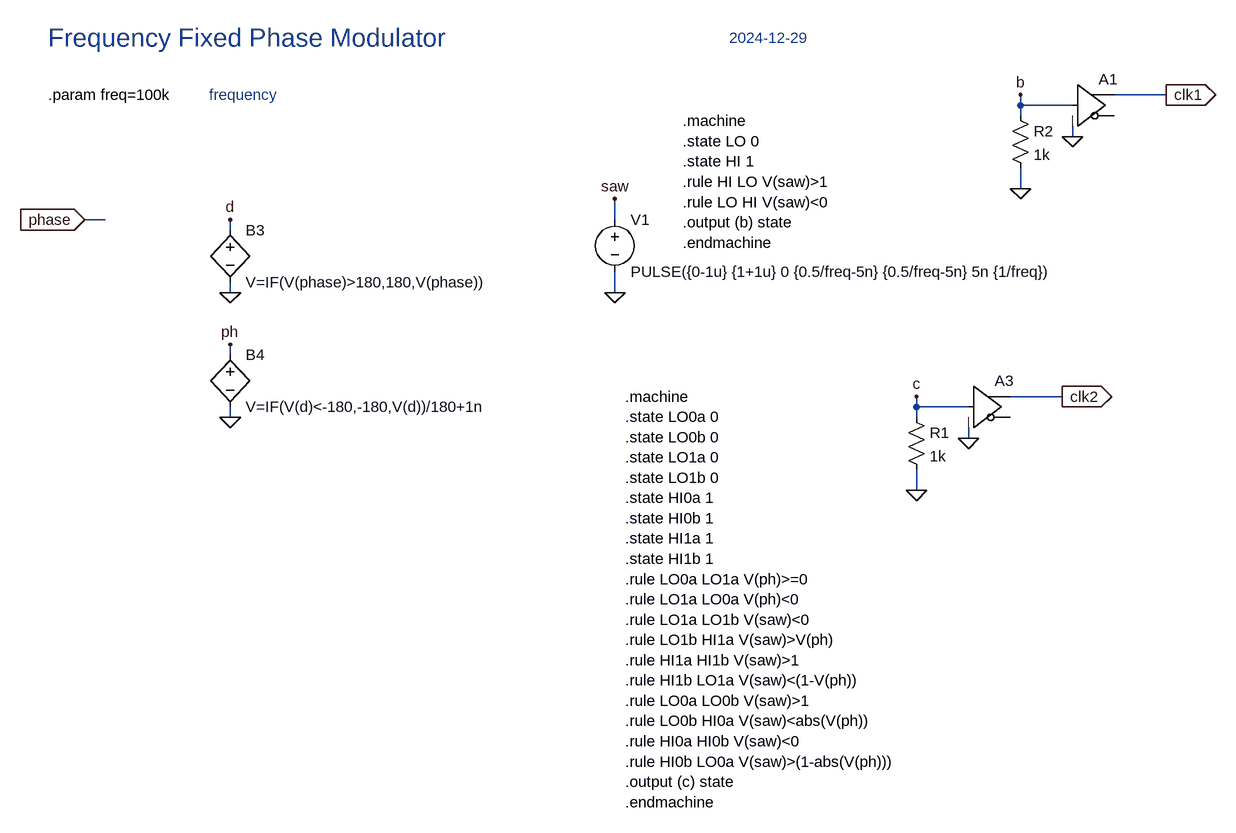
[diagram p0: schematic PHASESHIFT.asc]
PHASESHIFT.asc, the LTspice schematic file:
Version 4
SHEET 1 1572 1312
WIRE 560 16 480 16
WIRE 336 32 336 16
WIRE 416 32 336 32
WIRE 336 48 336 32
WIRE 416 80 416 64
WIRE 336 160 336 128
WIRE -1072 208 -1104 208
WIRE -288 208 -288 176
WIRE -880 224 -880 208
WIRE -880 320 -880 304
WIRE -288 320 -288 288
WIRE -880 416 -880 400
WIRE 400 480 320 480
WIRE 176 496 176 480
WIRE 256 496 176 496
WIRE -880 512 -880 496
WIRE 176 512 176 496
WIRE 256 544 256 528
WIRE 176 624 176 592
FLAG -1104 208 phase
IOPIN -1104 208 In
FLAG 336 160 0
FLAG -880 320 0
FLAG -880 208 d
FLAG 560 16 clk1
IOPIN 560 16 Out
FLAG 416 80 0
FLAG 336 16 b
FLAG 176 624 0
FLAG 400 480 clk2
IOPIN 400 480 Out
FLAG 256 544 0
FLAG 176 480 c
FLAG -880 400 ph
FLAG -288 320 0
FLAG -288 176 saw
FLAG -880 512 0
SYMBOL res 320 32 R0
SYMATTR InstName R2
SYMATTR Value 1k
SYMBOL bv -880 208 R0
SYMATTR InstName B3
SYMATTR Value V=IF(V(phase)>180,180,V(phase))
SYMBOL Digital\\buf 416 -32 R0
SYMATTR InstName A1
SYMBOL res 160 496 R0
SYMATTR InstName R1
SYMATTR Value 1k
SYMBOL Digital\\buf 256 432 R0
SYMATTR InstName A3
SYMBOL bv -880 400 R0
SYMATTR InstName B4
SYMATTR Value V=IF(V(d)<-180,-180,V(d))/180+1n
SYMBOL voltage -288 192 R0
WINDOW 123 0 0 Left 0
WINDOW 39 0 0 Left 0
SYMATTR InstName V1
SYMATTR Value PULSE({0-1u} {1+1u} 0 {0.5/freq-5n} {0.5/freq-5n} 5n {1/freq})
TEXT -272 480 Left 2 !.machine\n.state LO0a 0\n.state LO0b 0\n.state LO1a 0\n.state LO1b 0\n.state HI0a 1\n.state HI0b 1\n.state HI1a 1\n.state HI1b 1\n.rule LO0a LO1a V(ph)>=0\n.rule LO1a LO0a V(ph)<0\n.rule LO1a LO1b V(saw)<0\n.rule LO1b HI1a V(saw)>V(ph)\n.rule HI1a HI1b V(saw)>1\n.rule HI1b LO1a V(saw)<(1-V(ph))\n.rule LO0a LO0b V(saw)>1\n.rule LO0b HI0a V(saw)<abs(V(ph))\n.rule HI0a HI0b V(saw)<0\n.rule HI0b LO0a V(saw)>(1-abs(V(ph)))\n.output (c) state\n.endmachine
TEXT -1160 16 Left 2 !.param freq=100k
TEXT -184 56 Left 2 !.machine\n.state LO 0\n.state HI 1\n.rule HI LO V(saw)>1\n.rule LO HI V(saw)<0\n.output (b) state\n.endmachine
TEXT -1160 -72 Left 4 ;Frequency Fixed Phase Modulator
TEXT -912 16 Left 2 ;frequency
TEXT -112 -72 Left 2 ;2024-12-29

The netlist it stands for:
* PHASESHIFT.asc
R2 b 0 1k
B3 d 0 V=IF(V(phase)>180,180,V(phase))
A1 b 0 0 0 0 0 clk1 0 BUF
R1 c 0 1k
A3 c 0 0 0 0 0 clk2 0 BUF
B4 ph 0 V=IF(V(d)<-180,-180,V(d))/180+1n
V1 saw 0 PULSE({0-1u} {1+1u} 0 {0.5/freq-5n} {0.5/freq-5n} 5n {1/freq})
.machine
.state LO0a 0
.state LO0b 0
.state LO1a 0
.state LO1b 0
.state HI0a 1
.state HI0b 1
.state HI1a 1
.state HI1b 1
.rule LO0a LO1a V(ph)>=0
.rule LO1a LO0a V(ph)<0
.rule LO1a LO1b V(saw)<0
.rule LO1b HI1a V(saw)>V(ph)
.rule HI1a HI1b V(saw)>1
.rule HI1b LO1a V(saw)<(1-V(ph))
.rule LO0a LO0b V(saw)>1
.rule LO0b HI0a V(saw)<abs(V(ph))
.rule HI0a HI0b V(saw)<0
.rule HI0b LO0a V(saw)>(1-abs(V(ph)))
.output (c) state
.endmachine
.param freq=100k
.machine
.state LO 0
.state HI 1
.rule HI LO V(saw)>1
.rule LO HI V(saw)<0
.output (b) state
.endmachine
* Frequency Fixed Phase Modulator
* frequency
* 2024-12-29
.backanno
.end